# Altium project LPC1787-LCD-PCB.PrjPcb (part 3 of 3)

## Sheet POWER SUPPLY.SchDoc
size 474 x 261 mm
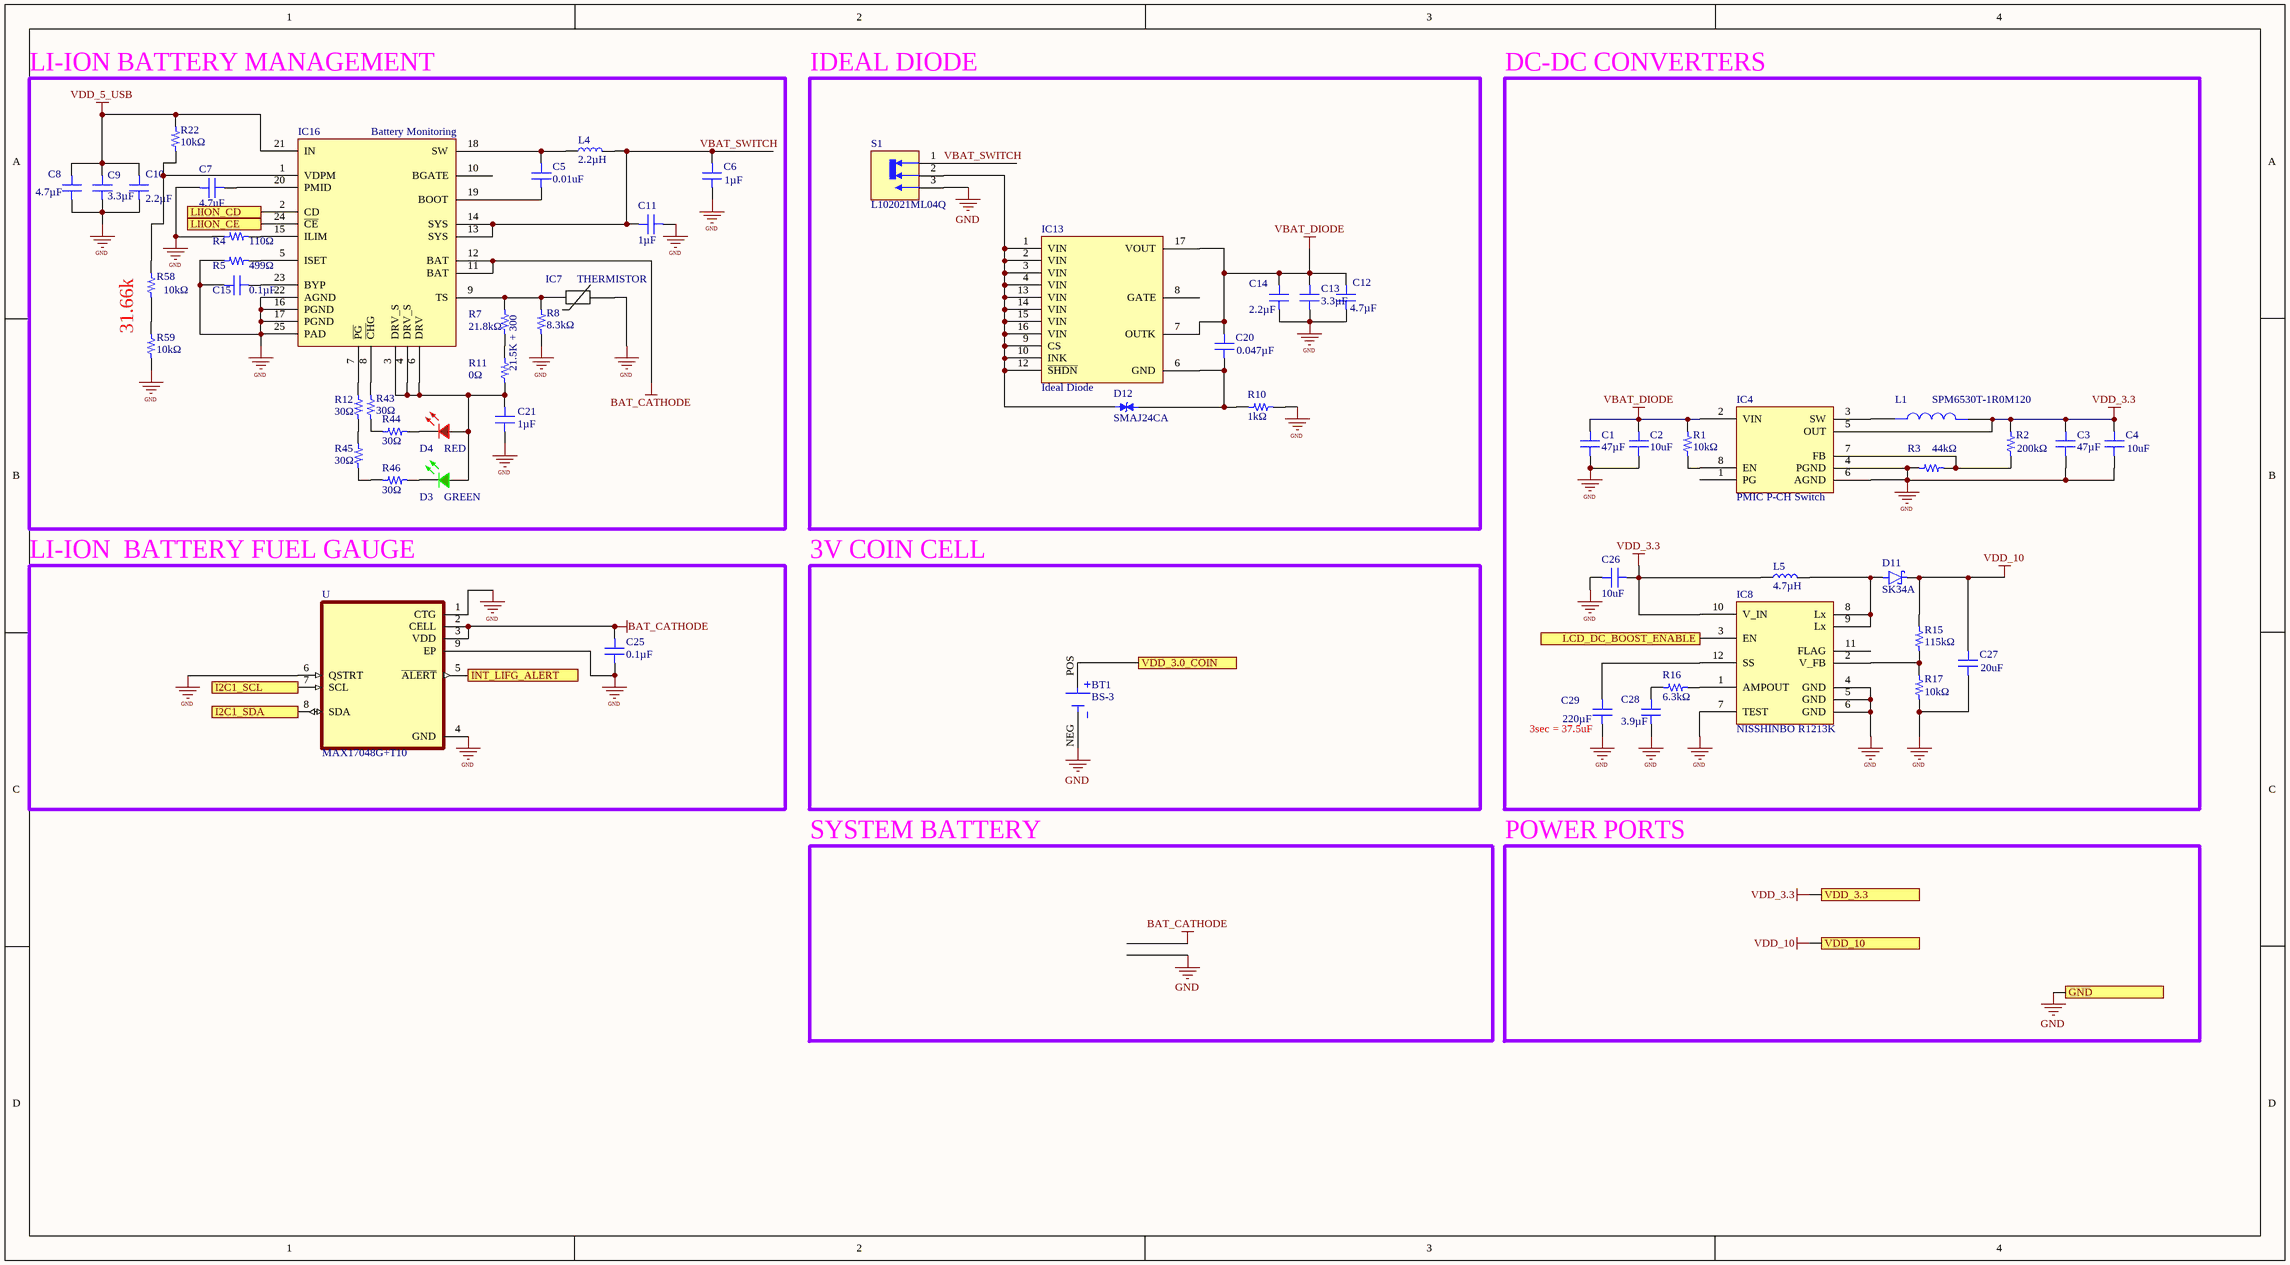
[diagram p11: POWER SUPPLY.SchDoc]

### Parts
BT1  BS-3  [BAT_BS-3]
C1  47µF  [CAP 1210_3225 - 2.2MM]
C2  10uF  [CAP 0603_1608]
C3  47µF  [CAP 1210_3225 - 2.2MM]
C4  10uF  [CAP 0603_1608]
C5  0.01uF  [CAP 0603_1608]
C6  1µF  [CAP 0603_1608]
C7  4.7uF  [CAP 0603_1608]
C8  4.7µF  [CAP 0805_2012]
C9  3.3µF  [0805_2012 RF]  (no BOM)
C10  2.2µF  [CAP 0603_1608]
C11  1µF  [CAP 0603_1608]
C12  4.7µF  [CAP 0805_2012]
C13  3.3µF  [0805_2012 RF]  (no BOM)
C14  2.2µF  [CAP 0603_1608]
C15  0.1µF  [CAP 0603_1608 RF]
C20  0.047µF  [CAP 0603_1608]
C21  1µF  [CAP 0603_1608]
C25  0.1µF  [CAP 0603_1608 RF]
C26  10uF  [CAP 0603_1608]
C27  20uF  [CAP 0603_1608]
C28  3.9µF  [CAP 0805_2012]
C29  220µF  [CAP 0805_2012]
D3  GREEN  [LED 0603_1608]
D4  RED  [LED 0603_1608]
D11  SK34A  [DIOM4325X250N]
D12  SMAJ24CA  [DIOM4325X250N]
IC4  PMIC P-CH Switch  [MPS MP2144 TSOT23-8]
IC7  THERMISTOR  [THERMISTOR 2TH]
IC8  NISSHINBO R1213K  [NISSHINBO R1213K]
IC13  Ideal Diode  [ANALOG DFN-16]
IC16  Battery Monitoring  [TI BQ24278]
L1  SPM6530T-1R0M120  [IND_SPM6530T-1R0M120]
L4  2.2µH  [IND 0806_2016]
L5  4.7µH  [NTC 0603_1608]
R1  10kΩ  [RES 0603_1608 RF]
R2  200kΩ  [RES 0603_1608 RF]
R3  44kΩ  [RES 0603_1608 RF]
R4  110Ω  [RES 0603_1608 RF]
R5  499Ω  [RES 0603_1608 RF]
R7  21.8kΩ  [RES 0603_1608 RF]
R8  8.3kΩ  [RES 0603_1608 RF]
R10  1kΩ  [RES 0603_1608 RF]
R11  0Ω  [RES 0603_1608 RF]
R12  30Ω  [RES 0603_1608 RF]
R15  115kΩ  [RES 0603_1608 RF]
R16  6.3kΩ  [RES 0603_1608 RF]
R17  10kΩ  [RES 0603_1608 RF]
R22  10kΩ  [RES 0603_1608 RF]
R43  30Ω  [RES 0603_1608 RF]
R44  30Ω  [RES 0603_1608 RF]
R45  30Ω  [RES 0603_1608 RF]
R46  30Ω  [RES 0603_1608 RF]
R58  10kΩ  [RES 0603_1608 RF]
R59  10kΩ  [RES 0603_1608 RF]
S1  L102021ML04Q  [SW_L102021ML04Q]
U  MAX17048G+T10  [SON50P200X200X80-9N]

### Blocks framed on the sheet
LI-ION BATTERY MANAGEMENT: C5-C11 C15 C21 D3 D4 IC7 IC16 L4 R4 R5 R7 R8 R11 R12 R22 R43-R46 R58 R59
IDEAL DIODE: C12-C14 C20 D12 IC13 R10 S1
DC-DC CONVERTERS: C1-C4 C26-C29 D11 IC4 IC8 L1 L5 R1-R3 R15-R17
LI-ION  BATTERY FUEL GAUGE: C25 U
3V COIN CELL: BT1

### Ports
GND, I2C1_SCL, I2C1_SDA, INT_LIFG_ALERT, LCD_DC_BOOST_ENABLE, LIION_CD, LIION_CE, VDD_3.0_COIN, VDD_3.3, VDD_10

### Nets
BAT_CATHODE: C25.2 IC16.11(BAT) IC16.12(BAT) U.2(CELL) U.3(VDD)
GND: BT1.NEG C1.1 C2.1 C3.1 C4.1 C6.1 C7.2 C8.1 C9.1 C10.1 C11.1 C12.1 C13.1 C14.1 C15.1 C21.1 C25.1 C26.1 C27.1 C28.1 C29.1 IC4.4(PGND) IC4.6(AGND) IC7.2 IC8.4(GND) IC8.5(GND) IC8.6(GND) IC8.7(TEST) IC16.16(PGND) IC16.17(PGND) IC16.22(AGND) IC16.25(PAD) R3.1 R4.1 R5.1 R8.2 R10.1 R17.1 R59.2 S1.3 U.1(CTG) U.4(GND) U.6(QSTRT) U.9(EP) ; port GND
VBAT_DIODE: C1.2 C2.2 C12.2 C13.2 C14.2 C20.2 IC4.2(VIN) IC13.7(OUTK) IC13.17(VOUT) R1.2
VDD_3.3: C3.2 C4.2 C26.2 IC4.5(OUT) IC8.10(V_IN) L1.2 L5.1 R2.2 ; port VDD_3.3  [project net VDD_3.3_1]
VDD_5_USB: C8.2 C9.2 C10.2 IC16.21(IN) R22.1
VDD_10: C27.2 D11.C(K) R15.2 ; port VDD_10
VBAT_SWITCH: C6.2 C11.2 IC16.13(SYS) IC16.14(SYS) L4.2 S1.1
NetA1_12: U.5(~{ALERT}) ; port INT_LIFG_ALERT
NetA1_19: IC16.2(CD) ; port LIION_CD
NetA1_25: IC16.24(~{CE}) ; port LIION_CE
NetA1_38: BT1.POS ; port VDD_3.0_COIN
NetA1_94: U.8(SDA) ; port I2C1_SDA
NetA1_96: U.7(SCL) ; port I2C1_SCL
NetA1_151: IC8.3(EN) ; port LCD_DC_BOOST_ENABLE
NetC5_1: C5.1 IC16.19(BOOT)
NetC5_2: C5.2 IC16.18(SW) L4.1
NetC7_1: C7.1 IC16.20(PMID)
NetC15_2: C15.2 IC16.23(BYP)
NetC20_1: C20.1 D12.2 IC13.6(GND) R10.2
NetC21_2: C21.2 D3.1 D4.1 IC16.3(DRV_S) IC16.4(DRV_S) IC16.6(DRV) R11.1
NetC28_2: C28.2 R16.1
NetC29_2: C29.2 IC8.12(SS)
NetD3_2: D3.2 R46.1
NetD4_2: D4.2 R44.1
NetD11_A: D11.A IC8.8(Lx) IC8.9(Lx) L5.2
NetD12_1: D12.1 IC13.1(VIN) IC13.2(VIN) IC13.3(VIN) IC13.4(VIN) IC13.9(CS) IC13.10(INK) IC13.12(~{SHDN}) IC13.13(VIN) IC13.14(VIN) IC13.15(VIN) IC13.16(VIN) S1.2
NetIC4_3: IC4.3(SW) L1.1
NetIC4_7: IC4.7(FB) R2.1 R3.2
NetIC4_8: IC4.8(EN) R1.1
NetIC7_1: IC7.1 IC16.9(TS) R7.2 R8.1
NetIC8_1: IC8.1(AMPOUT) R16.2
NetIC8_2: IC8.2(V_FB) R15.1 R17.2
NetIC16_1: IC16.1(VDPM) R22.2 R58.2
NetIC16_5: IC16.5(ISET) R5.2
NetIC16_7: IC16.7(~{PG}) R12.2
NetIC16_8: IC16.8(~{CH}G) R43.2
NetIC16_15: IC16.15(ILIM) R4.2
NetR7_1: R7.1 R11.2
NetR12_1: R12.1 R45.2
NetR43_1: R43.1 R44.2
NetR45_1: R45.1 R46.2
NetR58_1: R58.1 R59.1

Not connected (* = marked no-connect by the designer): IC4 1(PG); IC8 11(FLAG); IC13 8(GATE); IC16 10(BGATE)

### Notes on the sheet
- 31.66k
- 21.5K + 300
- (near C29) 3sec = 37.5uF
- SYSTEM BATTERY
- POWER PORTS
- Title
- Size:
- Date:
- File:
- A2
- Number:
- Time:
- Revision:
- Sheet
- of

### Library data of the parts
BT1 = BS-3: Holder Coincell 2032 Retainr Arm; MF: MPD (Memory; Price: None; Availability: Warning; Package: None; MP: BS-3; Value: *; SnapEDA_Link: https://www.snapeda.com/parts/BS-3/Memory%20Protection%20Devices/view-part/2280959/?ref=snap
C1 C3 = CAP00038: CAP CER 47UF 10V X7R 1210; Manufacturer: Murata Electronics; Manufacturer P/N: GRM32ER71A476ME15L; Tolerance: ±20%; Device ID: CAP00038; Mounting Type: Surface Mount; Part Type: Capacitor; VALUE: 47µF; Operating Temperature: -55°C ~ 125°C; Voltage: 10V; Package: 1210 (3225 Metric); Supplier1: Digi-Key; Supplier1 P/N: 490-6543-1-ND; Supplier2: Mouser; Supplier2 P/N: 81-GRM32ER71A476ME5L; Temperature Coefficient: X7R
C2 C4 C26 = CAP00045: CAP CER 10UF 6.3V X7R 0603; Manufacturer: TDK; Manufacturer P/N: C2012JB0J106M; Tolerance: ±10%; Device ID: CAP00045; Mounting Type: Surface Mount; Part Type: Capacitor; VALUE: 10uF; Operating Temperature: -55°C ~ 125°C; Voltage: 6.3V; Package: 0603 (1608 Metric); Supplier1: Digi-Key; Supplier1 P/N: 399-7891-1-ND; Supplier2: Mouser; Supplier2 P/N: 80-C0603C273K3R; Temperature Coefficient: X7R
C5 = CAP00049: CAP CER 0.01UF 25V X7R 0603; Manufacturer: TDK; Manufacturer P/N: C2012X5R1C106K; Tolerance: ±10%; Device ID: CAP00049; Mounting Type: Surface Mount; Part Type: Capacitor; VALUE: 0.01uF; Operating Temperature: -55°C ~ 125°C; Voltage: 25V; Package: 0603 (1608 Metric); Supplier1: Digi-Key; Supplier1 P/N: 399-7891-1-ND; Supplier2: Mouser; Supplier2 P/N: 80-C0603C273K3R; Temperature Coefficient: X7R
C6 C11 C21 = CAP00007: CAP CER 1UF 10V X7R 0603; Manufacturer: KEMET; Manufacturer P/N: C0603C105K8RACTU; Tolerance: ±10%; Device ID: CAP00007; Mounting Type: Surface Mount; Part Type: Capacitor; VALUE: 1µF; Operating Temperature: -55°C ~ 125°C; Voltage: 10V; Package: 0603 (1608 Metric); Supplier1: Digi-Key; Supplier1 P/N: 399-11133-1-ND; Supplier2: Mouser; Supplier2 P/N: 80-C0603C105K8R; Temperature Coefficient: X7R
C7 = CAP00044: CAP CER 4.7UF 50V X7R 0603; Manufacturer: KEMET; Manufacturer P/N: CL10A475KQ8NNNC; Voltage: 25V; Tolerance: ±10%; Device ID: CAP00044; Mounting Type: Surface Mount; Part Type: Capacitor; VALUE: 4.7uF; Operating Temperature: -55°C ~ 125°C; Package: 0603 (1608 Metric); Supplier1: Digi-Key; Supplier1 P/N: 399-7891-1-ND; Supplier2: Mouser; Supplier2 P/N: 80-C0603C273K3R; Temperature Coefficient: X7R
C8 C12 = CAP00014: CAP CER 4.7UF 16V X7R 0805; Manufacturer: KEMET; Manufacturer P/N: C0805C475K4RACTU; Tolerance: ±10%; Device ID: CAP00014; Mounting Type: Surface Mount; Part Type: Capacitor; VALUE: 4.7µF; Operating Temperature: -55°C ~ 125°C; Voltage: 16V; Package: 0805 (2012 Metric); Supplier1: Digi-Key; Supplier1 P/N: 399-7415-1-ND; Supplier2: Mouser; Supplier2 P/N: C0805C475K4RACTU; Temperature Coefficient: X7R
C9 C13 = CAP0004A: CAP CER 3.3UF 16V X7R 0805; Manufacturer: KEMET; Manufacturer P/N: C0805C475K4RACTU; Tolerance: ±10%; Device ID: CAP0004A; Mounting Type: Surface Mount; Part Type: Capacitor; VALUE: 3.3µF; Operating Temperature: -55°C ~ 125°C; Voltage: 16V; Package: 0805 (2012 Metric); Supplier1: Digi-Key; Supplier1 P/N: 399-7415-1-ND; Supplier2: Mouser; Supplier2 P/N: C0805C475K4RACTU; Temperature Coefficient: X7R
C10 C14 = CAP0000A: CAP CER 2.2UF 10V X7R 0603; Manufacturer: KEMET; Manufacturer P/N: C0603C225M8RACTU; Tolerance: ±20%; Device ID: CAP0000A; Mounting Type: Surface Mount; Part Type: Capacitor; VALUE: 2.2µF; Operating Temperature: -55°C ~ 125°C; Voltage: 10V; Package: 0603 (1608 Metric); Supplier1: Digi-Key; Supplier1 P/N: 399-11682-1-ND; Supplier2: Mouser; Supplier2 P/N: 80-C0603C225M8R; Temperature Coefficient: X7R
C15 C25 = CAP00039: CAP CER 0.1UF 16V X7R 0603; Manufacturer: KEMET; Manufacturer P/N: C0603C104M4RACAUTO; Tolerance: ±20%; Device ID: CAP00039; Mounting Type: Surface Mount; Part Type: Capacitor; VALUE: 0.1µF; Operating Temperature: -55°C ~ 125°C; Voltage: 16V; Package: 0603 (1608 Metric); Supplier1: Digi-Key; Supplier1 P/N: 399-C0603C104M4RACAUTOCT-ND; Supplier2: Mouser; Supplier2 P/N: C0603C104M4RACAUTO; Temperature Coefficient: X7R
C20 = CAP0000E: CAP CER 0.047UF 50V X7R 0603; Manufacturer: KEMET; Manufacturer P/N: C0603C473K5RACTU; Tolerance: ±10%; Device ID: CAP0000E; Mounting Type: Surface Mount; Part Type: Capacitor; VALUE: 0.047µF; Operating Temperature: -55°C ~ 125°C; Voltage: 50V; Package: 0603 (1608 Metric); Supplier1: Digi-Key; Supplier1 P/N: 399-7933-1-ND; Supplier2: Mouser; Supplier2 P/N: 80-C0603C473K5R; Temperature Coefficient: X7R
C27 = CAP00046: CAP CER 20UF 25V X7R 0603; Manufacturer: TDK; Manufacturer P/N: C2012X5R1C106K; Tolerance: ±10%; Device ID: CAP00046; Mounting Type: Surface Mount; Part Type: Capacitor; VALUE: 20uF; Operating Temperature: -55°C ~ 125°C; Voltage: 25V; Package: 0603 (1608 Metric); Supplier1: Digi-Key; Supplier1 P/N: 399-7891-1-ND; Supplier2: Mouser; Supplier2 P/N: 80-C0603C273K3R; Temperature Coefficient: X7R
C28 = CAP0004B: CAP CER 3.9UF 50V X7R 0805; Manufacturer: KEMET; Manufacturer P/N: C0805C223K5RAC7210; Tolerance: ±10%; Device ID: CAP0004B; Mounting Type: Surface Mount; Part Type: Capacitor; VALUE: 3.9µF; Operating Temperature: -55°C ~ 125°C; Voltage: 50V; Package: 0805 (2012 Metric); Supplier1: Digi-Key; Supplier1 P/N: 399-C0805C223K5RAC7210CT-ND; Supplier2: Mouser; Supplier2 P/N: 80-C0805C223K5RACLR; Temperature Coefficient: X7R
C29 = CAP0004C: CAP CER 220UF 50V X7R 0805; Manufacturer: KEMET; Manufacturer P/N: C0805C223K5RAC7210; Tolerance: ±10%; Device ID: CAP0004C; Mounting Type: Surface Mount; Part Type: Capacitor; VALUE: 220µF; Operating Temperature: -55°C ~ 125°C; Voltage: 50V; Package: 0805 (2012 Metric); Supplier1: Digi-Key; Supplier1 P/N: 399-C0805C223K5RAC7210CT-ND; Supplier2: Mouser; Supplier2 P/N: 80-C0805C223K5RACLR; Temperature Coefficient: X7R
D3 = LED0000B: LED RED CLEAR 0603 SMD; Manufacturer: Würth Elektronik; Manufacturer P/N: 150060RS75000; If - Forward Current: 100mA; Vf - Forward Voltage: 2.0V; Wavelength: 625nm; Viewing Angle: 140°; Lens Color: Colorless; Device ID: LED0000B; VALUE: GREEN; Mounting Type: Surface Mount; Part Type: LED; Operating Temperature: -40°C ~ 85°C; Package: 0603 (1608 Metric); Color: Red; Supplier1: Digi-Key; Supplier1 P/N: 732-4978-1-ND
D4 = LED0000A: LED RED CLEAR 0603 SMD; Manufacturer: Würth Elektronik; Manufacturer P/N: 150060RS75000; If - Forward Current: 100mA; Vf - Forward Voltage: 2.0V; Wavelength: 625nm; Viewing Angle: 140°; Lens Color: Colorless; Device ID: LED0000A; VALUE: RED; Mounting Type: Surface Mount; Part Type: LED; Operating Temperature: -40°C ~ 85°C; Package: 0603 (1608 Metric); Color: Red; Supplier1: Digi-Key; Supplier1 P/N: 732-4978-1-ND
IC4 = SWT00003: IC PWR SWITCH P-CHAN 1:1 4TDFN; Manufacturer: Vishay Siliconix; Manufacturer P/N: SIP32432DNP3-T1GE4; Switch Type: General Purpose; Number of Outputs: 1; Output Configuration: High Side; Output Type: P-Channel; Interface: On/Off; Voltage - Load: 1.5V ~ 5.5V; Voltage - Supply (Vcc/Vdd): Not Required; Current - Output (Max): 1.4A; Rds On (Typ): 105mOhm; Input Type: Non-Inverting; Fault Protection: Reverse Current; Device ID: SWT00003; Part Type: IC; VALUE: PMIC P-CH Switch; Operating Temperature: -40°C ~ 85°C (TA); Package: 4-TDFN (1.2x1.6); Ratio - Input:Output: 1:1; Features: Slew Rate Controlled; Supplier1: Digi-Key; Supplier1 P/N: SIP32432DNP3-T1GE4CT-ND; Supplier2: Mouser; Supplier2 P/N: 78-SIP32432DNP3T1GE4
IC7 = TMP00002: 10kΩ THERMISTOR 0603; Manufacturer: Texas Instruments; VALUE: -40°C ~ 125°C Temp Sense; Sensor Type: Digital, Local; Sensing Temperature - Local: -40°C ~ 125°C; Output Type: I²C/SMBus; Voltage - Supply: 1.4V ~ 3.6V; Resolution: 8b; Accuracy - Highest (Lowest): ±2°C (±3°C); Test Condition: -10°C ~ 100°C (-40°C ~ 125°C); Device ID: TMP00002; Part Type: IC; Operating Temperature: -40°C ~ 125°C; Package: 4-DSBGA; Mounting Type: Surface Mount; Sensing Temperature - Remote: -; Features: One-Shot, Shutdown Mode; Supplier1: Digi-Key; Supplier1 P/N: 296-28398-1-ND; Supplier2: Mouser; Supplier2 P/N: 595-TMP103AYFFT
IC8 = VRG00006: IC REG CONV BLUETTH 1OUT 12WSON; Manufacturer: Texas Instruments; Manufacturer P/N: TPS62740DSSR; VALUE: Buck Regulator; Voltage - Input (Max): 2.5V; Voltage - Input (Min): 2.2V; Voltage - Output (Max): 3.3V; Current - Output: 300mA; Number of Outputs: 2; Voltage - Output (Min/Fixed): 1.8V; Frequency - Switching: 2MHz; Function: Step-Down; Device ID: VRG00006; Part Type: IC; Operating Temperature: -40°C ~ 85°C (TA); Package: 12-WSON; Supplier1: Digi-Key; Supplier1 P/N: 296-39459-1-ND; Synchronous Rectifier: -; Supplier2: Mouser; Supplier2 P/N: 595-TPS62740DSSR; Mounting Type: Surface Mount
IC13 = DCN00001: IC OR CTRLR IDEAL DIODE SC70-6; Manufacturer: Texas Instruments; Manufacturer P/N: LM66100DCKR; FET Type: P-Channel; Ratio - Input:Output: 1:1; Internal Switch(s): Yes; Current - Output (Max): 1.5A; Voltage - Supply: 1.5V ~ 5.5V; Delay Time - ON: 27 µs; Delay Time - OFF: 2 µs; Device ID: DCN00001; Part Type: IC; VALUE: Ideal Diode; Operating Temperature: -40°C ~ 105°C; Package: SOT-363; Mounting Type: Surface Mount; Applications: General Purpose; Supplier1: Digi-Key; Supplier1 P/N: 296-53541-1-ND; Supplier2: Mouser; Supplier2 P/N: 595-LM66100DCKR
IC16 = BMG00003: IC BATT MON LI-ION 1CELL 24QFN; Manufacturer: Analog Devices Inc.; Manufacturer P/N: BQ24278; Number of Cells: 1; Interface: I²C; Device ID: BMG00003; Part Type: IC; VALUE: Battery Monitoring; Operating Temperature: -40°C ~ 125°C; Package: 12-LFCSP Exposed Pad; Function: Battery Monitor; Fault Protection: -; Supplier1: Digi-Key; Supplier1 P/N: TBD; Supplier2: Mouser; Supplier2 P/N: TBD
L1 = SPM6530T-1R0M120: 1 ÂµH Shielded Drum Core, Wirewound Inductor 13 A 7.81mOhm Max Nonstandard; MF: TDK; Availability: In Stock; Package: NON STANDARD-2 TDK; MP: SPM6530T-1R0M120; Value: *; SnapEDA_Link: https://www.snapeda.com/parts/SPM6530T-1R0M120/TDK/view-part/?ref=snap; Price: None; Purchase-URL: https://pricing.snapeda.com/search/part/SPM6530T-1R0M120/?ref=eda; Check_prices: https://www.snapeda.com/parts/SPM6530T-1R0M120/TDK/view-part/?ref=eda
L4 = IND00002: FIXED IND 2.2UH 1.8A 139 MOHM; Manufacturer: Samsung Electro-Mechanics; Manufacturer P/N: CIGT201610LH2R2MNE; Current Saturation: 2.3A; Tolerance: ±20%; DC Resistance: 0.139Ω; Material - Core: Metal Composite; Device ID: IND00002; Part Type: Inductor; VALUE: 2.2µH; Operating Temperature: -40°C ~ 125°C; Package: 0806 (2016 Metric); Supplier1: Digi-Key; Supplier1 P/N: 1276-6911-1-ND; Supplier2: Mouser; Supplier2 P/N: 187-CIGT201610LH2R2M; Q @ Freq: -; Frequency - Self Resonant: -; Mounting Type: Surface Mount
L5 = IND00003: FIXED IND 4.7UH 16V; Manufacturer: TDK Corporation; Manufacturer P/N: C2012X5R1C106K; Current Saturation: 90mA; Tolerance: ±20%; DC Resistance: 1.050Ω; Material - Core: Ferrite; Device ID: IND00003; Part Type: Inductor; VALUE: 4.7µH; Operating Temperature: -55°C ~ 125°C; Package: 0603 (1608 Metric); Supplier1: Digi-Key; Supplier1 P/N: 445-175588-1-ND; Supplier2: Mouser; Supplier2 P/N: 810-MLZ1608M100WTD25; Q @ Freq: -; Frequency - Self Resonant: -; Mounting Type: Surface Mount
R1 R17 R22 R58 R59 = RES0002B: RES 10k OHM 1% 1/10W 0603; Manufacturer: Vishay Dale; Manufacturer P/N: ‎CRCW0603820KFKEAC‎; Power: 0.100W; Device ID: RES0002B; VALUE: 10kΩ; Mounting Type: Surface Mount; Part Type: Resistor; Operating Temperature: -55°C ~ 155°C; Package: 0603 (1608 Metric); Tolerance: ±1%; Composition: Thick Film; Supplier1: Digi-Key; Supplier1 P/N: ‎541-5568-1-ND‎; Supplier2: Mouser; Supplier2 P/N: 71-CRCW0603820KFKEAC
R2 = RES0002F: RES 200k OHM 1% 1/10W 0603; Manufacturer: Vishay Dale; Manufacturer P/N: ‎CRCW0603820KFKEAC‎; Power: 0.100W; Device ID: RES0002F; VALUE: 200kΩ; Mounting Type: Surface Mount; Part Type: Resistor; Operating Temperature: -55°C ~ 155°C; Package: 0603 (1608 Metric); Tolerance: ±1%; Composition: Thick Film; Supplier1: Digi-Key; Supplier1 P/N: ‎541-5568-1-ND‎; Supplier2: Mouser; Supplier2 P/N: 71-CRCW0603820KFKEAC
R3 = RES0002E: RES 44k OHM 1% 1/10W 0603; Manufacturer: Vishay Dale; Manufacturer P/N: ‎CRCW0603820KFKEAC‎; Power: 0.100W; Device ID: RES0002E; VALUE: 44kΩ; Mounting Type: Surface Mount; Part Type: Resistor; Operating Temperature: -55°C ~ 155°C; Package: 0603 (1608 Metric); Tolerance: ±1%; Composition: Thick Film; Supplier1: Digi-Key; Supplier1 P/N: ‎541-5568-1-ND‎; Supplier2: Mouser; Supplier2 P/N: 71-CRCW0603820KFKEAC
R4 = RES00032: RES 110 OHM 1% 1/10W 0603; Manufacturer: Vishay Dale; Manufacturer P/N: ‎CRCW0603820KFKEAC‎; Power: 0.100W; Device ID: RES00032; VALUE: 110Ω; Mounting Type: Surface Mount; Part Type: Resistor; Operating Temperature: -55°C ~ 155°C; Package: 0603 (1608 Metric); Tolerance: ±1%; Composition: Thick Film; Supplier1: Digi-Key; Supplier1 P/N: ‎541-5568-1-ND‎; Supplier2: Mouser; Supplier2 P/N: 71-CRCW0603820KFKEAC
R5 = RES00016: RES SMD 499 OHM 1% 1/10W 0603; Manufacturer: Vishay Dale; Manufacturer P/N: CRCW0603499RFKEA; Power: 0.100W; Device ID: RES00016; VALUE: 499Ω; Mounting Type: Surface Mount; Part Type: Resistor; Operating Temperature: -55°C ~ 155°C; Package: 0603 (1608 Metric); Tolerance: ±1%; Composition: Thick Film; Supplier1: Digi-Key; Supplier1 P/N: 541-499HCT-ND; Supplier2: Mouser; Supplier2 P/N: 71-CRCW0603-499-E3
R7 = RES00031: RES 21.8k OHM 1% 1/10W 0603; Manufacturer: Vishay Dale; Manufacturer P/N: ‎CRCW0603820KFKEAC‎; Power: 0.100W; Device ID: RES00031; VALUE: 21.8kΩ; Mounting Type: Surface Mount; Part Type: Resistor; Operating Temperature: -55°C ~ 155°C; Package: 0603 (1608 Metric); Tolerance: ±1%; Composition: Thick Film; Supplier1: Digi-Key; Supplier1 P/N: ‎541-5568-1-ND‎; Supplier2: Mouser; Supplier2 P/N: 71-CRCW0603820KFKEAC
R8 = RES00030: RES 8.3k OHM 1% 1/10W 0603; Manufacturer: Vishay Dale; Manufacturer P/N: ‎CRCW0603820KFKEAC‎; Power: 0.100W; Device ID: RES00030; VALUE: 8.3kΩ; Mounting Type: Surface Mount; Part Type: Resistor; Operating Temperature: -55°C ~ 155°C; Package: 0603 (1608 Metric); Tolerance: ±1%; Composition: Thick Film; Supplier1: Digi-Key; Supplier1 P/N: ‎541-5568-1-ND‎; Supplier2: Mouser; Supplier2 P/N: 71-CRCW0603820KFKEAC
R10 = RES0000B: RES SMD 1K OHM 0.1% 1/10W 0603; Manufacturer: Susumu; Manufacturer P/N: RG1608P-102-B-T5; Power: 0.100W; Device ID: RES0000B; VALUE: 1kΩ; Mounting Type: Surface Mount; Part Type: Resistor; Operating Temperature: -55°C ~ 155°C; Package: 0603 (1608 Metric); Tolerance: ±0.1%; Composition: Thin Film; Supplier1: Digi-Key; Supplier1 P/N: RG16P1.0KBCT-ND; Supplier2: Mouser; Supplier2 P/N: 754-RG1608P-102-B-T5
R11 = RES00033: RES 0 OHM 1% 1/10W 0603; Manufacturer: Vishay Dale; Manufacturer P/N: ‎CRCW0603820KFKEAC‎; Power: 0.100W; Device ID: RES00033; VALUE: 0Ω; Mounting Type: Surface Mount; Part Type: Resistor; Operating Temperature: -55°C ~ 155°C; Package: 0603 (1608 Metric); Tolerance: ±1%; Composition: Thick Film; Supplier1: Digi-Key; Supplier1 P/N: ‎541-5568-1-ND‎; Supplier2: Mouser; Supplier2 P/N: 71-CRCW0603820KFKEAC
R12 R43-R46 = RES00039: RES 30 OHM 1% 1/10W 0603; Manufacturer: Vishay Dale; Manufacturer P/N: ‎CRCW0603820KFKEAC‎; Power: 0.100W; Device ID: RES00039; VALUE: 30Ω; Mounting Type: Surface Mount; Part Type: Resistor; Operating Temperature: -55°C ~ 155°C; Package: 0603 (1608 Metric); Tolerance: ±1%; Composition: Thick Film; Supplier1: Digi-Key; Supplier1 P/N: ‎541-5568-1-ND‎; Supplier2: Mouser; Supplier2 P/N: 71-CRCW0603820KFKEAC
R15 = RES0002C: RES 115k OHM 1% 1/10W 0603; Manufacturer: Vishay Dale; Manufacturer P/N: ‎CRCW0603820KFKEAC‎; Power: 0.100W; Device ID: RES0002C; VALUE: 115kΩ; Mounting Type: Surface Mount; Part Type: Resistor; Operating Temperature: -55°C ~ 155°C; Package: 0603 (1608 Metric); Tolerance: ±1%; Composition: Thick Film; Supplier1: Digi-Key; Supplier1 P/N: ‎541-5568-1-ND‎; Supplier2: Mouser; Supplier2 P/N: 71-CRCW0603820KFKEAC
R16 = RES0002D: RES 6.3k OHM 1% 1/10W 0603; Manufacturer: Vishay Dale; Manufacturer P/N: ‎CRCW0603820KFKEAC‎; Power: 0.100W; Device ID: RES0002D; VALUE: 6.3kΩ; Mounting Type: Surface Mount; Part Type: Resistor; Operating Temperature: -55°C ~ 155°C; Package: 0603 (1608 Metric); Tolerance: ±1%; Composition: Thick Film; Supplier1: Digi-Key; Supplier1 P/N: ‎541-5568-1-ND‎; Supplier2: Mouser; Supplier2 P/N: 71-CRCW0603820KFKEAC
S1 = L102021ML04Q: Slide Switch SPDT Through Hole, Right Angle; MF: C&K; Price: None; Purchase-URL: https://pricing.snapeda.com/search/part/L102021ML04Q/?ref=eda; Value: *; Check_prices: https://www.snapeda.com/parts/L102021ML04Q/C&K/view-part/458072/?ref=eda; Package: None; SnapEDA_Link: https://www.snapeda.com/parts/L102021ML04Q/C&K/view-part/458072/?ref=snap; MP: L102021ML04Q; Availability: Good
U = MAX17048G+T10: Battery Battery Monitor IC Lithium-Ion 8-TDFN-EP (2x2); MF: Maxim Integrated; Package: TDFN-8 Maxim; SnapEDA_Link: https://www.snapeda.com/parts/MAX17048G+T10/Maxim%20Integrated/view-part/329239/?ref=snap; Mouser-Purchase-URL: https://snapeda.com/shop?store=Mouser&id=329239; MP: MAX17048G+T10; Digi-Key_Part_Number: MAX17048G+T10CT-ND; Value: *
D11 = SK34A: Price: None; Availability: Unavailable; Value: *; MP: SK34A; Package: None
D12 = SMAJ24CA: Value: *; Package: None; Price: None; Availability: Unavailable; MP: SMAJ24CA

## Sheet MICROPHONE.SchDoc
size A
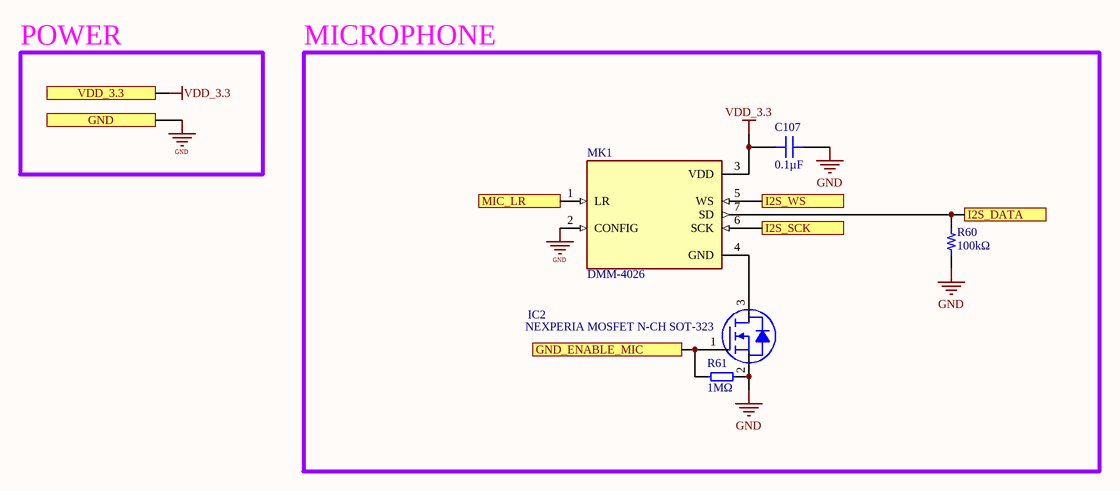
[diagram p12: MICROPHONE.SchDoc]

### Parts
C107  0.1µF  [CAP 0603_1608 RF]
IC2  NEXPERIA MOSFET N-CH SOT-323  [NEXPERIA SOT-323]
MK1  DMM-4026  [DMM-4026]
R60  100kΩ  [RES 0603_1608 RF]
R61  1MΩ  [0603_1608 RF]  (no BOM)

### Blocks framed on the sheet
MICROPHONE: C107 IC2 MK1 R60 R61

### Ports
GND, GND_ENABLE_MIC, I2S_DATA, I2S_SCK, I2S_WS, MIC_LR, VDD_3.3

### Nets
GND: C107.2 IC2.2(S) MK1.2(CONFIG) R60.1 R61.1 ; port GND
VDD_3.3: C107.1 MK1.3(VDD) ; port VDD_3.3  [project net VDD_3.3_1]
NetA1_14: MK1.7(SD) R60.2 ; port I2S_DATA
NetA1_16: MK1.5(WS) ; port I2S_WS
NetA1_18: MK1.6(SCK) ; port I2S_SCK
NetA1_206: IC2.1(G) R61.2 ; port GND_ENABLE_MIC
NetIC2_3: IC2.3(D) MK1.4(GND)
NetMK1_1: MK1.1(LR) ; port MIC_LR

### Notes on the sheet
- POWER

### Library data of the parts
C107 = CAP00039: as C15 on sheet POWER SUPPLY; Device ID: CAP00039; Mounting Type: Surface Mount; Part Type: Capacitor; VALUE: 0.1µF; Operating Temperature: -55°C ~ 125°C; Voltage: 16V; Package: 0603 (1608 Metric); Supplier1: Digi-Key; Supplier1 P/N: 399-C0603C104M4RACAUTOCT-ND; Supplier2: Mouser; Supplier2 P/N: C0603C104M4RACAUTO; Temperature Coefficient: X7R
IC2 = MOS00000: MOSFET N-CH 60V 320MA SOT323; Manufacturer: Nexperia USA Inc.; Manufacturer P/N: BSS138PW,115; FET Type: N-Channel; VALUE: NFET; Current - Continuous Drain (Id) @ 25°C: 320mA (Ta); Drive Voltage (Max Rds On, Min Rds On): 10V; Rds On (Max) @ Id, Vgs: 1.6Ohm @ 300mA, 10V; Vgs(th) (Max) @ Id: 1.5V @ 250µA; Vgs (Max): ±20V; Power Dissipation (Max): 260mW (Ta), 830mW (Tc); Gate Charge (Qg) (Max) @ Vgs: 0.8 nC @ 4.5 V; Input Capacitance (Ciss) (Max) @ Vds: 50 pF @ 10 V; Device ID: MOS00000; Package: SOT-323; Part Type: IC; Technology: MOSFET (Metal Oxide); FET Feature: -; Operating Temperature: -55°C ~ 150°C (TA); Mounting Type: Surface Mount; Drain to Source Voltage (Vdss): 60V; Supplier1: Digi-Key; Supplier1 P/N: 1727-1143-1-ND; Supplier2: Mouser; Supplier2 P/N: 771-BSS138PW115
MK1 = MIC00001: DIFFERENTIAL ANALOG OUTPUT MEMS; Manufacturer: TDK InvenSense; Manufacturer P/N: ICS-40638; MP: DMM-4026-B-I2S-R; Value: MEMS Microphone; MF: PUI Audio, Inc.; Current - Supply: 170µA; Voltage Supply: 1.52V ~ 3.63V; Bandwidth: 35Hz ~ 20.0kHz; Direction: Omnidirectional; Sensitivity: -43dB ±1dB @ 94dB SPL; Impedance: 355Ω; S/N Ratio: 63dB; Check_prices: https://www.snapeda.com/parts/DMM-4026-B-I2S-R/PUI+Audio%252C+Inc./view-part/?ref=eda; Purchase-URL: https://pricing.snapeda.com/search/part/DMM-4026-B-I2S-R/?ref=eda; SnapEDA_Link: https://www.snapeda.com/parts/DMM-4026-B-I2S-R/PUI+Audio%252C+Inc./view-part/?ref=snap; Digi-Key_Part_Number: 668-DMM-4026-B-I2S-RCT-ND; Package: 5-Pad Custom SMD; Device ID: MIC00001; Part Type: IC; Operating Temperature: -40°C ~ 105°C; Supplier1: Digi-Key; Output Type: Differential Analog; Supplier1 P/N: 1428-ICS-40638CT-ND; Supplier2: Mouser; Supplier2 P/N: 410-ICS-40638; Mounting Type: Surface Mount
R60 = RES00025: RES 100k OHM 1% 1/10W 0603; Manufacturer: Vishay Dale; Manufacturer P/N: ‎CRCW0603820KFKEAC‎; Power: 0.100W; Device ID: RES00025; VALUE: 100kΩ; Mounting Type: Surface Mount; Part Type: Resistor; Operating Temperature: -55°C ~ 155°C; Package: 0603 (1608 Metric); Tolerance: ±1%; Composition: Thick Film; Supplier1: Digi-Key; Supplier1 P/N: ‎541-5568-1-ND‎; Supplier2: Mouser; Supplier2 P/N: 71-CRCW0603820KFKEAC
R61 = RFP00002: 0603 RF Passive; VALUE: 0603; Device ID: RFP00002; Mounting Type: Surface Mount; Part Type: Passive

## Sheet RAM & FLASH.SchDoc
size A
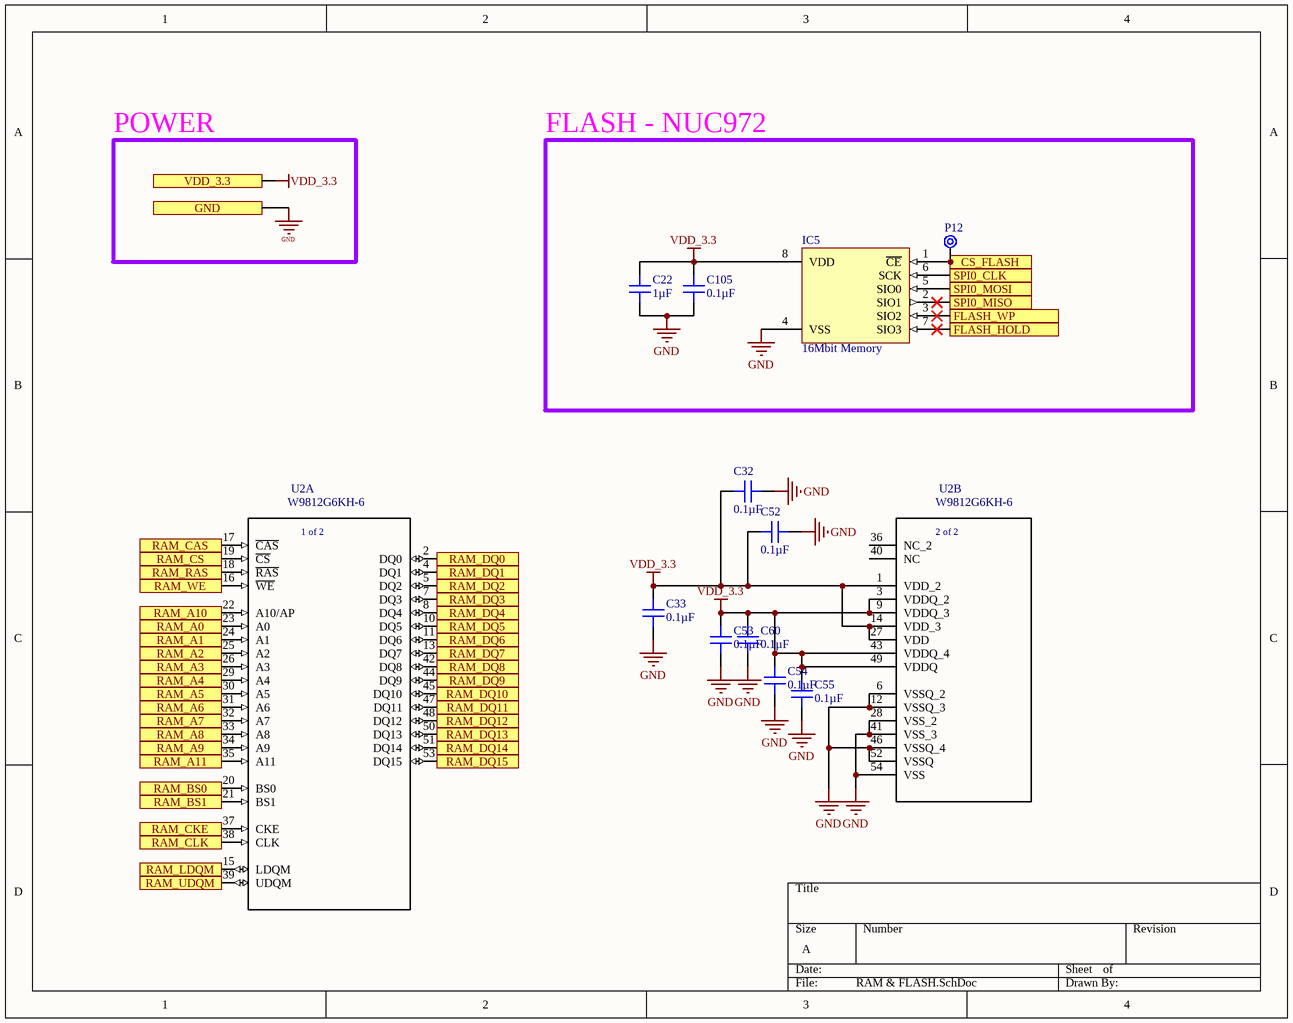
[diagram p13: RAM & FLASH.SchDoc]

### Parts
C22  1µF  [CAP 0603_1608]
C32  0.1µF  [CAP 0603_1608 RF]
C33  0.1µF  [CAP 0603_1608 RF]
C52  0.1µF  [CAP 0603_1608 RF]
C53  0.1µF  [CAP 0603_1608 RF]
C54  0.1µF  [CAP 0603_1608 RF]
C55  0.1µF  [CAP 0603_1608 RF]
C60  0.1µF  [CAP 0603_1608 RF]
C105  0.1µF  [CAP 0603_1608 RF]
IC5  16Mbit Memory  [MICROCHIP SOIC-8 150mil Wide]
P12  1 Pin  [1PINTHRU]  (value not drawn)
U2  W9812G6KH-6  [*WIN_TSOP-54_WIN]  (parts A,B of 2)

### Blocks framed on the sheet
FLASH - NUC972: C22 C105 IC5 P12

### Ports
CS_FLASH, FLASH_HOLD, FLASH_WP, GND, RAM_A0, RAM_A1, RAM_A2, RAM_A3, RAM_A4, RAM_A5, RAM_A6, RAM_A7, RAM_A8, RAM_A9, RAM_A10, RAM_A11, RAM_BS0, RAM_BS1, RAM_CAS, RAM_CKE, RAM_CLK, RAM_CS, RAM_DQ0, RAM_DQ1, RAM_DQ2, RAM_DQ3, RAM_DQ4, RAM_DQ5, RAM_DQ6, RAM_DQ7, RAM_DQ8, RAM_DQ9, RAM_DQ10, RAM_DQ11, RAM_DQ12, RAM_DQ13, RAM_DQ14, RAM_DQ15, RAM_LDQM, RAM_RAS, RAM_UDQM, RAM_WE, SPI0_CLK, SPI0_MISO, SPI0_MOSI, VDD_3.3

### Nets
GND: C22.1 C32.2 C33.2 C52.2 C53.2 C54.2 C55.2 C60.2 C105.2 IC5.4(VSS) U2.6(VSSQ_2) U2.12(VSSQ_3) U2.28(VSS_2) U2.41(VSS_3) U2.46(VSSQ_4) U2.52(VSSQ) U2.54(VSS) ; port GND
VDD_3.3: C22.2 C32.1 C33.1 C52.1 C53.1 C54.1 C55.1 C60.1 C105.1 IC5.8(VDD) U2.1(VDD_2) U2.3(VDDQ_2) U2.9(VDDQ_3) U2.14(VDD_3) U2.27(VDD) U2.43(VDDQ_4) U2.49(VDDQ) ; port VDD_3.3  [project net VDD_3.3_1]
NetA1_1: U2.48(DQ12) ; port RAM_DQ12
NetA1_3: U2.7(DQ3) ; port RAM_DQ3
NetA1_7: U2.50(DQ13) ; port RAM_DQ13
NetA1_13: U2.8(DQ4) ; port RAM_DQ4
NetA1_17: U2.10(DQ5) ; port RAM_DQ5
NetA1_21: U2.51(DQ14) ; port RAM_DQ14
NetA1_23: U2.11(DQ6) ; port RAM_DQ6
NetA1_27: U2.13(DQ7) ; port RAM_DQ7
NetA1_28: U2.53(DQ15) ; port RAM_DQ15
NetA1_43: U2.39(UDQM) ; port RAM_UDQM
NetA1_49: U2.15(LDQM) ; port RAM_LDQM
NetA1_53: U2.37(CKE) ; port RAM_CKE
NetA1_59: U2.38(CLK) ; port RAM_CLK
NetA1_75: U2.23(A0) ; port RAM_A0
NetA1_79: U2.24(A1) ; port RAM_A1
NetA1_83: U2.25(A2) ; port RAM_A2
NetA1_87: U2.17(~{CAS}) ; port RAM_CAS
NetA1_95: U2.18(~{RAS}) ; port RAM_RAS
NetA1_97: U2.26(A3) ; port RAM_A3
NetA1_103: U2.29(A4) ; port RAM_A4
NetA1_107: U2.30(A5) ; port RAM_A5
NetA1_113: U2.31(A6) ; port RAM_A6
NetA1_121: U2.32(A7) ; port RAM_A7
NetA1_124: IC5.5(SIO0) ; port SPI0_MOSI
NetA1_126: IC5.2(SIO1) ; port SPI0_MISO
NetA1_127: U2.33(A8) ; port RAM_A8
NetA1_128: IC5.6(SCK) ; port SPI0_CLK
NetA1_131: U2.34(A9) ; port RAM_A9
NetA1_135: U2.22(A10/AP) ; port RAM_A10
NetA1_145: U2.35(A11) ; port RAM_A11
NetA1_149: U2.20(BS0) ; port RAM_BS0
NetA1_155: U2.21(BS1) ; port RAM_BS1
NetA1_179: U2.16(~{WE}) ; port RAM_WE
NetA1_187: U2.19(~{CS}) ; port RAM_CS
NetA1_190: IC5.1(~{CE}) P12.1(PAD) ; port CS_FLASH
NetA1_191: U2.42(DQ8) ; port RAM_DQ8
NetA1_192: IC5.3(SIO2) ; port FLASH_WP
NetA1_193: IC5.7(SIO3) ; port FLASH_HOLD
NetA1_197: U2.2(DQ0) ; port RAM_DQ0
NetA1_199: U2.44(DQ9) ; port RAM_DQ9
NetA1_201: U2.4(DQ1) ; port RAM_DQ1
NetA1_205: U2.45(DQ10) ; port RAM_DQ10
NetA1_207: U2.5(DQ2) ; port RAM_DQ2
NetA1_208: U2.47(DQ11) ; port RAM_DQ11

Not connected (* = marked no-connect by the designer): U2 36(NC_2) 40(NC)

### Notes on the sheet
- POWER
- (in symbol W9812G6KH-6, part A) 1 of 2
- (in symbol W9812G6KH-6, part B) 2 of 2

### Library data of the parts
C22 = CAP00007: as C6 on sheet POWER SUPPLY; Device ID: CAP00007; Mounting Type: Surface Mount; Part Type: Capacitor; VALUE: 1µF; Operating Temperature: -55°C ~ 125°C; Voltage: 10V; Package: 0603 (1608 Metric); Supplier1: Digi-Key; Supplier1 P/N: 399-11133-1-ND; Supplier2: Mouser; Supplier2 P/N: 80-C0603C105K8R; Temperature Coefficient: X7R
C32 C33 C52-C55 C60 C105 = CAP00039: as C15 on sheet POWER SUPPLY; Device ID: CAP00039; Mounting Type: Surface Mount; Part Type: Capacitor; VALUE: 0.1µF; Operating Temperature: -55°C ~ 125°C; Voltage: 16V; Package: 0603 (1608 Metric); Supplier1: Digi-Key; Supplier1 P/N: 399-C0603C104M4RACAUTOCT-ND; Supplier2: Mouser; Supplier2 P/N: C0603C104M4RACAUTO; Temperature Coefficient: X7R
IC5 = MEM00002: IC FLASH 4MBIT SPI 40MHZ 8SOIC; Manufacturer: Microchip Technology; Manufacturer P/N: SST25PF040CT-40E/SN; Memory Type: Non-Volatile; Memory Size: 16Mb (512K x 8); Write Cycle Time - Word, Page: 5ms; Voltage - Supply: 2.3V ~ 3.6V; Device ID: MEM00002; Part Type: IC; VALUE: 16Mbit Memory; Operating Temperature: -40°C ~ 125°C (TA); Package: 8-SOIC; Mounting Type: Surface Mount; Memory Format: FLASH; Technology: FLASH; Memory Interface: SPI; Clock Frequency: 40MHz; Supplier1: Mouser; Supplier1 P/N: 579-T26VF016BT-80ESN / SST26VF016BT-80E/SN
P12 = 1 THRU HOLE: Device ID: CON00017; VALUE: 1 Pin Thru; Connector Type: Center Strip Contacts; Style: Board to Board; Number of Positions: 1; Number of Positions Loaded: All; Mounting Type: Surface Mount; Part Type: Header; Package: N/A; Contact Type: Pins; Pitch - Mating: -; Fastening Type: -; Contact Finish - Mating: Tin; Insulation Color: -; Material Flammability Rating: -; Current Rating (Amps): -; Voltage Rating: -; Supplier1: -; Supplier1 P/N: -; Supplier2: -; Supplier2 P/N: -
U2 = W9812G6KH-6: SDRAM Memory IC 128Mb (8M x 16) Parallel 166 MHz 5 ns 54-TSOP II; MF: Winbond Electronics; Package: TSOP-54 Winbond Electronics; Price: None; Check_prices: https://www.snapeda.com/parts/W9812G6KH-6/Winbond+Electronics/view-part/?ref=eda; SnapEDA_Link: https://www.snapeda.com/parts/W9812G6KH-6/Winbond+Electronics/view-part/?ref=snap; MP: W9812G6KH-6; Availability: In Stock; Purchase-URL: https://pricing.snapeda.com/search?q=W9812G6KH-6&ref=eda; Value: *

## Sheet ESP32.SchDoc
size A
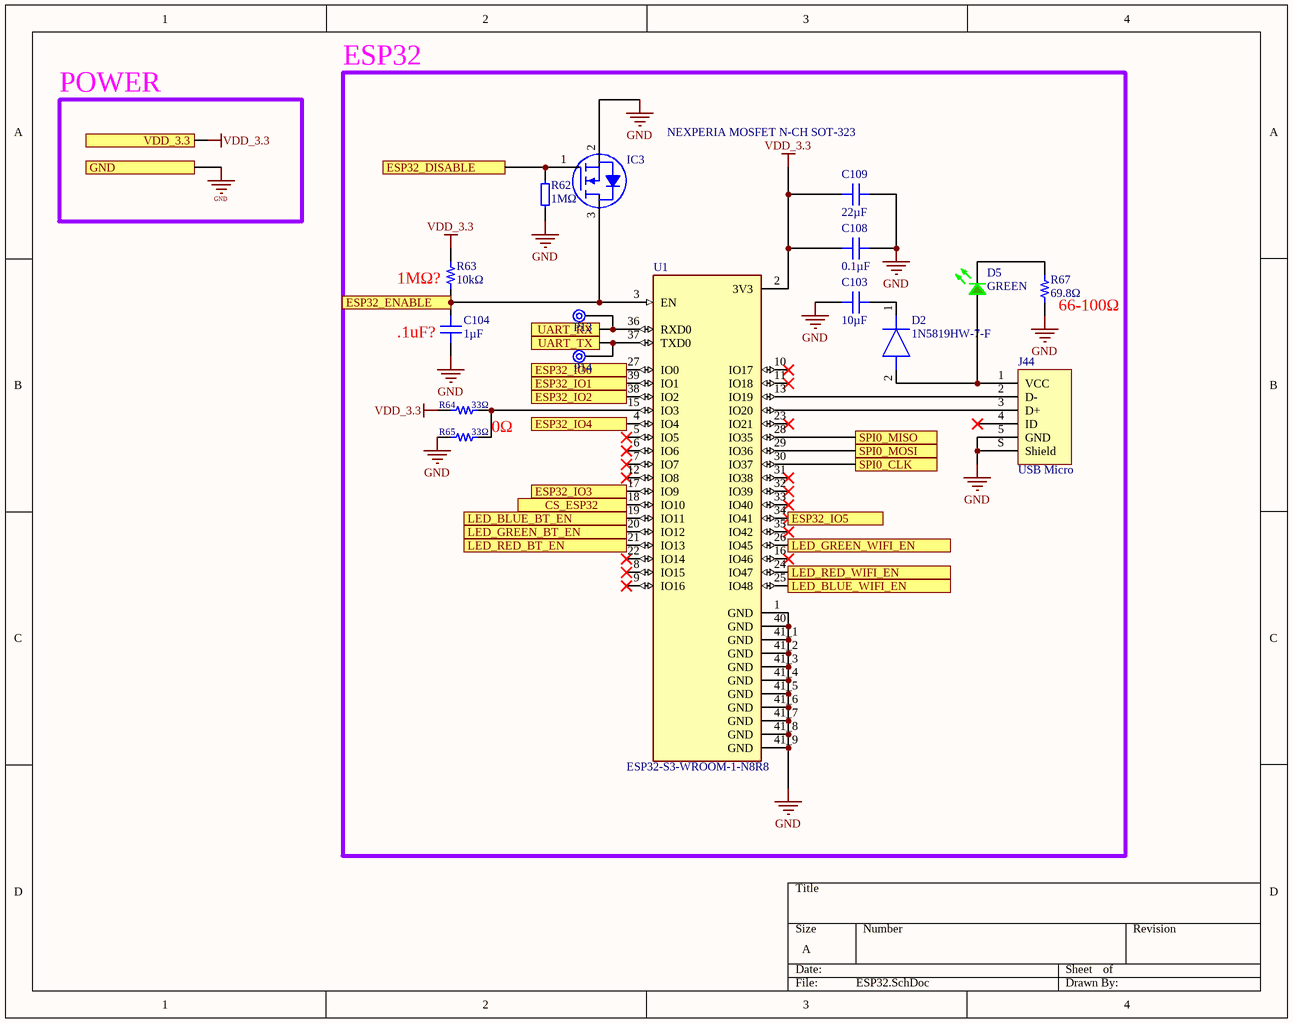
[diagram p14: ESP32.SchDoc]

### Parts
C103  10µF  [CAP 0603_1608]
C104  1µF  [CAP 0603_1608]
C108  0.1µF  [CAP 0603_1608 RF]
C109  22µF  [CAP 0805_2012]
D2  1N5819HW-7-F  [SOD3716X125N]
D5  GREEN  [LED 0603_1608]
IC3  NEXPERIA MOSFET N-CH SOT-323  [NEXPERIA SOT-323]
J44  USB Micro  [MICRO USB B]
P13  1 Pin  [1PINTHRU]  (value not drawn)
P14  1 Pin  [1PINTHRU]  (value not drawn)
R62  1MΩ  [0603_1608 RF]  (no BOM)
R63  10kΩ  [RES 0603_1608 RF]
R64  33Ω  [RES 0201_0603]
R65  33Ω  [RES 0201_0603]
R67  69.8Ω  [RES 0603_1608 RF]
U1  ESP32-S3-WROOM-1-N8R8  [XCVR_ESP32S3WROOM1N8R8]

### Ports
CS_ESP32, ESP32_DISABLE, ESP32_ENABLE, ESP32_IO0, ESP32_IO1, ESP32_IO2, ESP32_IO3, ESP32_IO4, ESP32_IO5, GND, LED_BLUE_BT_EN, LED_BLUE_WIFI_EN, LED_GREEN_BT_EN, LED_GREEN_WIFI_EN, LED_RED_BT_EN, LED_RED_WIFI_EN, SPI0_CLK, SPI0_MISO, SPI0_MOSI, UART_RX, UART_TX, VDD_3.3

### Nets
GND: C103.1 C104.1 C108.1 C109.2 IC3.2(S) J44.5(GND) J44.S(Shield) R62.2 R65.1 R67.1 U1.1(GND) U1.40(GND) U1.41_1(GND) U1.41_2(GND) U1.41_3(GND) U1.41_4(GND) U1.41_5(GND) U1.41_6(GND) U1.41_7(GND) U1.41_8(GND) U1.41_9(GND) ; port GND
VDD_3.3: C108.2 C109.1 R63.2 R64.1 U1.2(3V3) ; port VDD_3.3  [project net VDD_3.3_1]
NetA1_108: U1.34(IO41) ; port ESP32_IO5
NetA1_124: U1.29(IO36) ; port SPI0_MOSI
NetA1_126: U1.28(IO35) ; port SPI0_MISO
NetA1_128: U1.30(IO37) ; port SPI0_CLK
NetA1_130: U1.18(IO10) ; port CS_ESP32
NetA1_147: U1.17(IO9) ; port ESP32_IO3
NetA1_152: U1.39(IO1) ; port ESP32_IO1
NetA1_156: U1.38(IO2) ; port ESP32_IO2
NetA1_159: IC3.1(G) R62.1 ; port ESP32_DISABLE
NetA1_171: U1.4(IO4) ; port ESP32_IO4
NetC97_1: C104.2 IC3.3(D) R63.1 U1.3(EN) ; port ESP32_ENABLE
NetC98_1: U1.27(IO0) ; port ESP32_IO0
NetC103_2: C103.2 D2.1(K)
NetD2_2: D2.2(A) D5.1 J44.1(VCC)
NetD5_2: D5.2 R67.2
NetIC14_20: P14.1(PAD) U1.37(TXD0) ; port UART_TX
NetIC14_21: P13.1(PAD) U1.36(RXD0) ; port UART_RX
NetJ44_2: J44.2(D-) U1.13(IO19)
NetJ44_3: J44.3(D+) U1.14(IO20)
NetR30_1: U1.20(IO12) ; port LED_GREEN_BT_EN
NetR34_1: U1.19(IO11) ; port LED_BLUE_BT_EN
NetR35_1: U1.25(IO48) ; port LED_BLUE_WIFI_EN
NetR37_1: U1.26(IO45) ; port LED_GREEN_WIFI_EN
NetR41_1: U1.21(IO13) ; port LED_RED_BT_EN
NetR42_1: U1.24(IO47) ; port LED_RED_WIFI_EN
NetR64_2: R64.2 R65.2 U1.15(IO3)

Not connected (* = marked no-connect by the designer): J44 4(ID)*; U1 5(IO5)* 6(IO6)* 7(IO7)* 8(IO15)* 9(IO16)* 10(IO17)* 11(IO18)* 12(IO8)* 16(IO46)* 22(IO14)* 23(IO21)* 31(IO38)* 32(IO39)* 33(IO40)* 35(IO42)*

### Notes on the sheet
- POWER
- ESP32
- 1MΩ?
- (near C104) .1uF?
- (near R67) 66-100Ω
- 0Ω

### Library data of the parts
C103 = CAP00040: CAP CER 010UF 25V X7R 0603; Manufacturer: KEMET; Manufacturer P/N: C0603C273K3RACTU; Tolerance: ±10%; Device ID: CAP00040; Mounting Type: Surface Mount; Part Type: Capacitor; VALUE: 10µF; Operating Temperature: -55°C ~ 125°C; Voltage: 25V; Package: 0603 (1608 Metric); Supplier1: Digi-Key; Supplier1 P/N: 399-7891-1-ND; Supplier2: Mouser; Supplier2 P/N: 80-C0603C273K3R; Temperature Coefficient: X7R
C104 = CAP00007: as C6 on sheet POWER SUPPLY; Device ID: CAP00007; Mounting Type: Surface Mount; Part Type: Capacitor; VALUE: 1µF; Operating Temperature: -55°C ~ 125°C; Voltage: 10V; Package: 0603 (1608 Metric); Supplier1: Digi-Key; Supplier1 P/N: 399-11133-1-ND; Supplier2: Mouser; Supplier2 P/N: 80-C0603C105K8R; Temperature Coefficient: X7R
C108 = CAP00039: as C15 on sheet POWER SUPPLY; Device ID: CAP00039; Mounting Type: Surface Mount; Part Type: Capacitor; VALUE: 0.1µF; Operating Temperature: -55°C ~ 125°C; Voltage: 16V; Package: 0603 (1608 Metric); Supplier1: Digi-Key; Supplier1 P/N: 399-C0603C104M4RACAUTOCT-ND; Supplier2: Mouser; Supplier2 P/N: C0603C104M4RACAUTO; Temperature Coefficient: X7R
C109 = CAP0003F: CAP CER 22UF 10V X7R 0805; Manufacturer: Murata Electronics; Manufacturer P/N: GRM21BZ71A226ME15L; Tolerance: ±20%; Device ID: CAP0003F; Mounting Type: Surface Mount; Part Type: Capacitor; VALUE: 22µF; Operating Temperature: -55°C ~ 125°C; Voltage: 10V; Package: 0805 (2012 Metric); Supplier1: Digi-Key; Supplier1 P/N: 490-GRM21BZ71A226ME15LCT-ND; Supplier2: -; Supplier2 P/N: -; Temperature Coefficient: X7R
D2 = 1N5819HW-7-F: Diode; Manufacturer_Name: MULTICOMP; Height: 1.25mm; Manufacturer_Part_Number: 1N5819HW-7-F
D5 = LED0000B: as D3 on sheet POWER SUPPLY; Device ID: LED0000B; VALUE: GREEN; Mounting Type: Surface Mount; Part Type: LED; Operating Temperature: -40°C ~ 85°C; Package: 0603 (1608 Metric); Color: Red; Supplier1: Digi-Key; Supplier1 P/N: 732-4978-1-ND
IC3 = MOS00000: as IC2 on sheet MICROPHONE; Device ID: MOS00000; Package: SOT-323; Part Type: IC; Technology: MOSFET (Metal Oxide); FET Feature: -; Operating Temperature: -55°C ~ 150°C (TA); Mounting Type: Surface Mount; Drain to Source Voltage (Vdss): 60V; Supplier1: Digi-Key; Supplier1 P/N: 1727-1143-1-ND; Supplier2: Mouser; Supplier2 P/N: 771-BSS138PW115
J44 = USB MICRO B: Manufacturer: TE; Manufacturer P/N: 123; Device ID: CON00014; VALUE: 5-Pin Board-to-Cable; Connector Type: Center Strip Contacts; Style: Board to Board; Number of Positions: 9; Number of Positions Loaded: All; Pitch - Mating: 0.012" (0.30mm); Mounting Type: Surface Mount; Part Type: Header; Operating Temperature: -40°C ~ 105°C; Package: N/A; Contact Type: Pins; Fastening Type: -; Contact Finish - Mating: Tin; Insulation Color: -; Material Flammability Rating: -; Current Rating (Amps): -; Voltage Rating: -; Supplier1: Digi-Key; Supplier1 P/N: 1253-046844745002846+CT-ND; Supplier2: Mouser; Supplier2 P/N: 346-046844745002846+
P13 P14 = 1 THRU HOLE: as P12 on sheet RAM & FLASH; Mounting Type: Surface Mount; Part Type: Header; Package: N/A; Contact Type: Pins; Pitch - Mating: -; Fastening Type: -; Contact Finish - Mating: Tin; Insulation Color: -; Material Flammability Rating: -; Current Rating (Amps): -; Voltage Rating: -; Supplier1: -; Supplier1 P/N: -; Supplier2: -; Supplier2 P/N: -
R62 = RFP00002: 0603 RF Passive; VALUE: 0603; Device ID: RFP00002; Mounting Type: Surface Mount; Part Type: Passive
R63 = RES0001B: RES SMD 10K OHM 5% 1/10W 0603; Manufacturer: Vishay Dale; Manufacturer P/N: CRCW060310K0JNEA; Power: 0.100W; Device ID: RES0001B; VALUE: 10kΩ; Mounting Type: Surface Mount; Part Type: Resistor; Operating Temperature: -55°C ~ 155°C; Package: 0603 (1608 Metric); Tolerance: ±5%; Composition: Thick Film; Supplier1: Digi-Key; Supplier1 P/N: 541-10KGCT-ND; Supplier2: Mouser; Supplier2 P/N: 71-CRCW0603J-10K-E3
R64 R65 = RES0003A: RES SMD 33 OHM 1% 1/20W 0201; Manufacturer: Vishay Dale; Manufacturer P/N: CRCW020110R0FNED; Power: 0.050W; Device ID: RES0003A; VALUE: 33Ω; Mounting Type: Surface Mount; Part Type: Resistor; Operating Temperature: -55°C ~ 155°C; Package: 0201 (0603 Metric); Tolerance: ±1%; Composition: Thick Film; Supplier1: Digi-Key; Supplier1 P/N: 541-10.0ABCT-ND; Supplier2: Mouser; Supplier2 P/N: 71-CRCW020110R0FNED
R67 = RES00037: RES 69.8 OHM 1% 1/10W 0603; Manufacturer: Vishay Dale; Manufacturer P/N: ‎CRCW0603820KFKEAC‎; Power: 0.100W; Device ID: RES00037; VALUE: 69.8Ω; Mounting Type: Surface Mount; Part Type: Resistor; Operating Temperature: -55°C ~ 155°C; Package: 0603 (1608 Metric); Tolerance: ±1%; Composition: Thick Film; Supplier1: Digi-Key; Supplier1 P/N: ‎541-5568-1-ND‎; Supplier2: Mouser; Supplier2 P/N: 71-CRCW0603820KFKEAC
U1 = ESP32-S3-WROOM-1-N8R8: Bluetooth, WiFi 802.11b/g/n, Bluetooth v5.0 Transceiver Module 2.4GHz PCB Trace Surface Mount; MF: Espressif Systems; Price: None; Availability: In Stock; Package: None; MP: ESP32-S3-WROOM-1-N8R8; Value: *; SnapEDA_Link: https://www.snapeda.com/parts/ESP32-S3-WROOM-1-N8R8/Espressif+Systems/view-part/?ref=snap; Check_prices: https://www.snapeda.com/parts/ESP32-S3-WROOM-1-N8R8/Espressif+Systems/view-part/?ref=eda; Purchase-URL: https://pricing.snapeda.com/search/part/ESP32-S3-WROOM-1-N8R8/?ref=eda

## Sheet LCD.SchDoc
size A
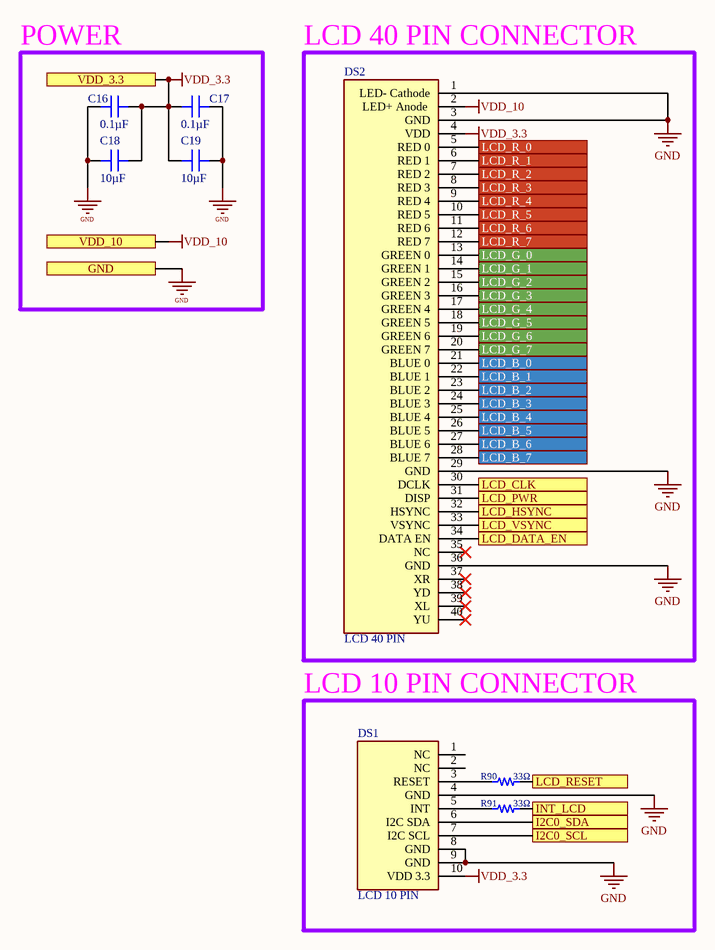
[diagram p15: LCD.SchDoc]

### Parts
C16  0.1µF  [CAP 0603_1608 RF]
C17  0.1µF  [CAP 0603_1608 RF]
C18  10µF  [CAP 0603_1608]
C19  10µF  [CAP 0603_1608]
DS1  LCD 10 PIN  [4DLCD-70800480-CTP-CLB 10 PIN]
DS2  LCD 40 PIN  [4DLCD-70800480-CTP-CLB 40 PIN]
R90  33Ω  [RES 0201_0603]
R91  33Ω  [RES 0201_0603]

### Blocks framed on the sheet
POWER: C16-C19
LCD 40 PIN CONNECTOR: DS2
LCD 10 PIN CONNECTOR: DS1 R90 R91

### Ports
GND, I2C0_SCL, I2C0_SDA, INT_LCD, LCD_B_0, LCD_B_1, LCD_B_2, LCD_B_3, LCD_B_4, LCD_B_5, LCD_B_6, LCD_B_7, LCD_CLK, LCD_DATA_EN, LCD_G_0, LCD_G_1, LCD_G_2, LCD_G_3, LCD_G_4, LCD_G_5, LCD_G_6, LCD_G_7, LCD_HSYNC, LCD_PWR, LCD_R_0, LCD_R_1, LCD_R_2, LCD_R_3, LCD_R_4, LCD_R_5, LCD_R_6, LCD_R_7, LCD_RESET, LCD_VSYNC, VDD_3.3, VDD_10

### Nets
GND: C16.2 C17.1 C18.2 C19.1 DS1.4(GND) DS1.8(GND) DS1.9(GND) DS2.1(LED-_Cathode) DS2.3(GND) DS2.29(GND) DS2.36(GND) ; port GND
VDD_3.3: C16.1 C17.2 C18.1 C19.2 DS1.10(VDD_3.3) DS2.4(VDD) ; port VDD_3.3  [project net VDD_3.3_1]
VDD_10: DS2.2(LED+_Anode) ; port VDD_10
NetA1_41: R91.2 ; port INT_LCD
NetA1_48: DS1.7(I2C_SCL) ; port I2C0_SCL
NetA1_50: DS1.6(I2C_SDA) ; port I2C0_SDA
NetA1_70: DS2.15(GREEN_2) ; port LCD_G_2
NetA1_72: DS2.16(GREEN_3) ; port LCD_G_3
NetA1_74: DS2.17(GREEN_4) ; port LCD_G_4
NetA1_76: DS2.18(GREEN_5) ; port LCD_G_5
NetA1_78: DS2.19(GREEN_6) ; port LCD_G_6
NetA1_80: DS2.20(GREEN_7) ; port LCD_G_7
NetA1_82: DS2.25(BLUE_4) ; port LCD_B_4
NetA1_88: DS2.26(BLUE_5) ; port LCD_B_5
NetA1_90: DS2.27(BLUE_6) ; port LCD_B_6
NetA1_92: DS2.28(BLUE_7) ; port LCD_B_7
NetA1_102: DS2.24(BLUE_3) ; port LCD_B_3
NetA1_106: DS2.23(BLUE_2) ; port LCD_B_2
NetA1_132: DS2.12(RED_7) ; port LCD_R_7
NetA1_134: DS2.11(RED_6) ; port LCD_R_6
NetA1_136: DS2.10(RED_5) ; port LCD_R_5
NetA1_138: DS2.9(RED_4) ; port LCD_R_4
NetA1_140: DS2.32(HSYNC) ; port LCD_HSYNC
NetA1_142: DS2.34(DATA_EN) ; port LCD_DATA_EN
NetA1_144: DS2.33(VSYNC) ; port LCD_VSYNC
NetA1_150: DS2.30(DCLK) ; port LCD_CLK
NetA1_154: DS2.31(DISP) ; port LCD_PWR
NetA1_158: DS2.22(BLUE_1) ; port LCD_B_1
NetA1_160: DS2.21(BLUE_0) ; port LCD_B_0
NetA1_162: DS2.14(GREEN_1) ; port LCD_G_1
NetA1_164: DS2.13(GREEN_0) ; port LCD_G_0
NetA1_166: DS2.6(RED_1) ; port LCD_R_1
NetA1_168: DS2.5(RED_0) ; port LCD_R_0
NetA1_170: DS2.7(RED_2) ; port LCD_R_2
NetA1_176: DS2.8(RED_3) ; port LCD_R_3
NetA1_203: R90.2 ; port LCD_RESET
NetDS1_3: DS1.3(RESET) R90.1
NetDS1_5: DS1.5(INT) R91.1

Not connected (* = marked no-connect by the designer): DS1 1(NC) 2(NC); DS2 35(NC)* 37(XR)* 38(YD)* 39(XL)* 40(YU)*

### Library data of the parts
C16 C17 = CAP00039: as C15 on sheet POWER SUPPLY; Device ID: CAP00039; Mounting Type: Surface Mount; Part Type: Capacitor; VALUE: 0.1µF; Operating Temperature: -55°C ~ 125°C; Voltage: 16V; Package: 0603 (1608 Metric); Supplier1: Digi-Key; Supplier1 P/N: 399-C0603C104M4RACAUTOCT-ND; Supplier2: Mouser; Supplier2 P/N: C0603C104M4RACAUTO; Temperature Coefficient: X7R
C18 C19 = CAP00040: as C103 on sheet ESP32; Device ID: CAP00040; Mounting Type: Surface Mount; Part Type: Capacitor; VALUE: 10µF; Operating Temperature: -55°C ~ 125°C; Voltage: 25V; Package: 0603 (1608 Metric); Supplier1: Digi-Key; Supplier1 P/N: 399-7891-1-ND; Supplier2: Mouser; Supplier2 P/N: 80-C0603C273K3R; Temperature Coefficient: X7R
DS1 = LED00009: LED GRN/RED CLEAR 4SMD BOTTOM; Manufacturer: Würth Elektronik; Manufacturer P/N: 156125RV73000; VALUE: LCD DISPLAY; Color: Green/Red; If - Forward Current: 20mA Green, 20mA Red; Vf - Forward Voltage: 2.1V Green, 2V Red; Wavelength: 571nm Green, 624nm Red; Device ID: LED00009; Mounting Type: Ribbon; Part Type: LED; Operating Temperature: -40°C ~ 85°C; Package: 4-SMD; Viewing Angle: -; Lens Color: -; Supplier1: Digi-Key; Supplier1 P/N: 732-11429-1-ND; Supplier2: Mouser; Supplier2 P/N: 710-156125RV73000
DS2 = LED00008: LED GRN/RED CLEAR 4SMD BOTTOM; Manufacturer: Würth Elektronik; Manufacturer P/N: 156125RV73000; VALUE: LCD DISPLAY; Color: Green/Red; If - Forward Current: 20mA Green, 20mA Red; Vf - Forward Voltage: 2.1V Green, 2V Red; Wavelength: 571nm Green, 624nm Red; Device ID: LED00008; Mounting Type: Ribbon; Part Type: LED; Operating Temperature: -40°C ~ 85°C; Package: 4-SMD; Viewing Angle: -; Lens Color: -; Supplier1: Digi-Key; Supplier1 P/N: 732-11429-1-ND; Supplier2: Mouser; Supplier2 P/N: 710-156125RV73000
R90 R91 = RES0003A: as R64 on sheet ESP32; Device ID: RES0003A; VALUE: 33Ω; Mounting Type: Surface Mount; Part Type: Resistor; Operating Temperature: -55°C ~ 155°C; Package: 0201 (0603 Metric); Tolerance: ±1%; Composition: Thick Film; Supplier1: Digi-Key; Supplier1 P/N: 541-10.0ABCT-ND; Supplier2: Mouser; Supplier2 P/N: 71-CRCW020110R0FNED

## Nets that join several sheets
GND: ACCELEROMETER (IC1.2 R32.1), SOC LPC1787 (68 pins), LEDS & BUTTONS (9 pins), RTC (IC15.2), POWER SUPPLY (44 pins), MICROPHONE (5 pins), RAM & FLASH (17 pins), ESP32 (21 pins), LCD (11 pins)
VDD_3.3_1: ACCELEROMETER (C94.2 C95.2 IC10.5 IC10.8), SOC LPC1787 (61 pins), LEDS & BUTTONS (Db.1 Ds.1 Dw.1 R38.2), POWER SUPPLY (8 pins), MICROPHONE (C107.1 MK1.3), RAM & FLASH (17 pins), ESP32 (5 pins), LCD (6 pins)
VDD_5_USB: SOC LPC1787 (8 pins), POWER SUPPLY (5 pins)
VDD_10: POWER SUPPLY (C27.2 D11.C R15.2), LCD (DS2.2)
NetA1_1: SOC LPC1787 (A1.1), RAM & FLASH (U2.48)
NetA1_3: SOC LPC1787 (A1.3), RAM & FLASH (U2.7)
NetA1_7: SOC LPC1787 (A1.7), RAM & FLASH (U2.50)
NetA1_12: SOC LPC1787 (A1.12), POWER SUPPLY (U.5)
NetA1_13: SOC LPC1787 (A1.13), RAM & FLASH (U2.8)
NetA1_14: SOC LPC1787 (A1.14 P2.1), MICROPHONE (MK1.7 R60.2)
NetA1_16: SOC LPC1787 (A1.16 P3.1), MICROPHONE (MK1.5)
NetA1_17: SOC LPC1787 (A1.17), RAM & FLASH (U2.10)
NetA1_18: SOC LPC1787 (A1.18 P4.1), MICROPHONE (MK1.6)
NetA1_19: SOC LPC1787 (A1.19), POWER SUPPLY (IC16.2)
NetA1_21: SOC LPC1787 (A1.21), RAM & FLASH (U2.51)
NetA1_23: SOC LPC1787 (A1.23), RAM & FLASH (U2.11)
NetA1_25: SOC LPC1787 (A1.25), POWER SUPPLY (IC16.24)
NetA1_27: SOC LPC1787 (A1.27), RAM & FLASH (U2.13)
NetA1_28: SOC LPC1787 (A1.28), RAM & FLASH (U2.53)
NetA1_35: SOC LPC1787 (A1.35 R25.2), LEDS & BUTTONS (C96.2 R38.1 S1_1.3 S1_1.4)
NetA1_38: SOC LPC1787 (A1.38), RTC (IC15.5), POWER SUPPLY (BT1.POS)
NetA1_41: SOC LPC1787 (A1.41), LCD (R91.2)
NetA1_43: SOC LPC1787 (A1.43), RAM & FLASH (U2.39)
NetA1_48: SOC LPC1787 (A1.48 P8.1 R28.1), LCD (DS1.7)
NetA1_49: SOC LPC1787 (A1.49), RAM & FLASH (U2.15)
NetA1_50: SOC LPC1787 (A1.50 P9.1 R29.1), LCD (DS1.6)
NetA1_53: SOC LPC1787 (A1.53), RAM & FLASH (U2.37)
NetA1_54: SOC LPC1787 (A1.54), RTC (IC15.4)
NetA1_59: SOC LPC1787 (A1.59), RAM & FLASH (U2.38)
NetA1_70: SOC LPC1787 (A1.70), LCD (DS2.15)
NetA1_72: SOC LPC1787 (A1.72), LCD (DS2.16)
NetA1_74: SOC LPC1787 (A1.74), LCD (DS2.17)
NetA1_75: SOC LPC1787 (A1.75), RAM & FLASH (U2.23)
NetA1_76: SOC LPC1787 (A1.76), LCD (DS2.18)
NetA1_78: SOC LPC1787 (A1.78), LCD (DS2.19)
NetA1_79: SOC LPC1787 (A1.79), RAM & FLASH (U2.24)
NetA1_80: SOC LPC1787 (A1.80), LCD (DS2.20)
NetA1_82: SOC LPC1787 (A1.82), LCD (DS2.25)
NetA1_83: SOC LPC1787 (A1.83), RAM & FLASH (U2.25)
NetA1_87: SOC LPC1787 (A1.87), RAM & FLASH (U2.17)
NetA1_88: SOC LPC1787 (A1.88), LCD (DS2.26)
NetA1_90: SOC LPC1787 (A1.90), LCD (DS2.27)
NetA1_92: SOC LPC1787 (A1.92), LCD (DS2.28)
NetA1_94: SOC LPC1787 (A1.94 P10.1 R31.1), RTC (IC15.8), POWER SUPPLY (U.8)
NetA1_95: SOC LPC1787 (A1.95), RAM & FLASH (U2.18)
NetA1_96: SOC LPC1787 (A1.96 P11.1 R39.1), RTC (IC15.7), POWER SUPPLY (U.7)
NetA1_97: SOC LPC1787 (A1.97), RAM & FLASH (U2.26)
NetA1_102: SOC LPC1787 (A1.102), LCD (DS2.24)
NetA1_103: SOC LPC1787 (A1.103), RAM & FLASH (U2.29)
NetA1_106: SOC LPC1787 (A1.106), LCD (DS2.23)
NetA1_107: SOC LPC1787 (A1.107), RAM & FLASH (U2.30)
NetA1_108: SOC LPC1787 (A1.108), ESP32 (U1.34)
NetA1_113: SOC LPC1787 (A1.113), RAM & FLASH (U2.31)
NetA1_116: ACCELEROMETER (IC10.9), SOC LPC1787 (A1.116)
NetA1_118: ACCELEROMETER (IC10.4), SOC LPC1787 (A1.118)
NetA1_120: ACCELEROMETER (IC10.12), SOC LPC1787 (A1.120 P7.1)
NetA1_121: SOC LPC1787 (A1.121), RAM & FLASH (U2.32)
NetA1_122: ACCELEROMETER (IC1.1 R32.2), SOC LPC1787 (A1.122)
NetA1_124: ACCELEROMETER (IC10.14), SOC LPC1787 (A1.124 P1.1), RAM & FLASH (IC5.5), ESP32 (U1.29)
NetA1_126: ACCELEROMETER (IC10.1), SOC LPC1787 (A1.126 P6.1), RAM & FLASH (IC5.2), ESP32 (U1.28)
NetA1_127: SOC LPC1787 (A1.127), RAM & FLASH (U2.33)
NetA1_128: ACCELEROMETER (IC10.13), SOC LPC1787 (A1.128 P5.1), RAM & FLASH (IC5.6), ESP32 (U1.30)
NetA1_130: SOC LPC1787 (A1.130), ESP32 (U1.18)
NetA1_131: SOC LPC1787 (A1.131), RAM & FLASH (U2.34)
NetA1_132: SOC LPC1787 (A1.132), LCD (DS2.12)
NetA1_134: SOC LPC1787 (A1.134), LCD (DS2.11)
NetA1_135: SOC LPC1787 (A1.135), RAM & FLASH (U2.22)
NetA1_136: SOC LPC1787 (A1.136), LCD (DS2.10)
NetA1_137: SOC LPC1787 (A1.137), LEDS & BUTTONS (R40.1)
NetA1_138: SOC LPC1787 (A1.138), LCD (DS2.9)
NetA1_139: SOC LPC1787 (A1.139), LEDS & BUTTONS (R33.1)
NetA1_140: SOC LPC1787 (A1.140), LCD (DS2.32)
NetA1_141: SOC LPC1787 (A1.141), LEDS & BUTTONS (R36.1)
NetA1_142: SOC LPC1787 (A1.142), LCD (DS2.34)
NetA1_144: SOC LPC1787 (A1.144), LCD (DS2.33)
NetA1_145: SOC LPC1787 (A1.145), RAM & FLASH (U2.35)
NetA1_147: SOC LPC1787 (A1.147), ESP32 (U1.17)
NetA1_149: SOC LPC1787 (A1.149), RAM & FLASH (U2.20)
NetA1_150: SOC LPC1787 (A1.150), LCD (DS2.30)
NetA1_151: SOC LPC1787 (A1.151), POWER SUPPLY (IC8.3)
NetA1_152: SOC LPC1787 (A1.152), ESP32 (U1.39)
NetA1_154: SOC LPC1787 (A1.154), LCD (DS2.31)
NetA1_155: SOC LPC1787 (A1.155), RAM & FLASH (U2.21)
NetA1_156: SOC LPC1787 (A1.156), ESP32 (U1.38)
NetA1_158: SOC LPC1787 (A1.158), LCD (DS2.22)
NetA1_159: SOC LPC1787 (A1.159), ESP32 (IC3.1 R62.1)
NetA1_160: SOC LPC1787 (A1.160), LCD (DS2.21)
NetA1_162: SOC LPC1787 (A1.162), LCD (DS2.14)
NetA1_164: SOC LPC1787 (A1.164), LCD (DS2.13)
NetA1_166: SOC LPC1787 (A1.166), LCD (DS2.6)
NetA1_168: SOC LPC1787 (A1.168), LCD (DS2.5)
NetA1_170: SOC LPC1787 (A1.170), LCD (DS2.7)
NetA1_171: SOC LPC1787 (A1.171), ESP32 (U1.4)
NetA1_176: SOC LPC1787 (A1.176), LCD (DS2.8)
NetA1_179: SOC LPC1787 (A1.179), RAM & FLASH (U2.16)
NetA1_187: SOC LPC1787 (A1.187), RAM & FLASH (U2.19)
NetA1_190: SOC LPC1787 (A1.190), RAM & FLASH (IC5.1 P12.1)
NetA1_191: SOC LPC1787 (A1.191), RAM & FLASH (U2.42)
NetA1_192: SOC LPC1787 (A1.192), RAM & FLASH (IC5.3)
NetA1_193: SOC LPC1787 (A1.193), RAM & FLASH (IC5.7)
NetA1_197: SOC LPC1787 (A1.197), RAM & FLASH (U2.2)
NetA1_199: SOC LPC1787 (A1.199), RAM & FLASH (U2.44)
NetA1_201: SOC LPC1787 (A1.201), RAM & FLASH (U2.4)
NetA1_203: SOC LPC1787 (A1.203), LCD (R90.2)
NetA1_205: SOC LPC1787 (A1.205), RAM & FLASH (U2.45)
NetA1_206: SOC LPC1787 (A1.206), MICROPHONE (IC2.1 R61.2)
NetA1_207: SOC LPC1787 (A1.207), RAM & FLASH (U2.5)
NetA1_208: SOC LPC1787 (A1.208), RAM & FLASH (U2.47)
NetC97_1: LEDS & BUTTONS (C97.1 S2.3 S2.4), ESP32 (C104.2 IC3.3 R63.1 U1.3)
NetC98_1: LEDS & BUTTONS (C98.1 S3.3 S3.4), ESP32 (U1.27)
NetIC14_20: SOC LPC1787 (IC14.20), ESP32 (P14.1 U1.37)
NetIC14_21: SOC LPC1787 (IC14.21), ESP32 (P13.1 U1.36)
NetMK1_1: SOC LPC1787 (R66.2 R68.2), MICROPHONE (MK1.1)
NetR30_1: LEDS & BUTTONS (R30.1), ESP32 (U1.20)
NetR34_1: LEDS & BUTTONS (R34.1), ESP32 (U1.19)
NetR35_1: LEDS & BUTTONS (R35.1), ESP32 (U1.25)
NetR37_1: LEDS & BUTTONS (R37.1), ESP32 (U1.26)
NetR41_1: LEDS & BUTTONS (R41.1), ESP32 (U1.21)
NetR42_1: LEDS & BUTTONS (R42.1), ESP32 (U1.24)